# EAGLE design myLCD5Cape (EAGLE 5.11)
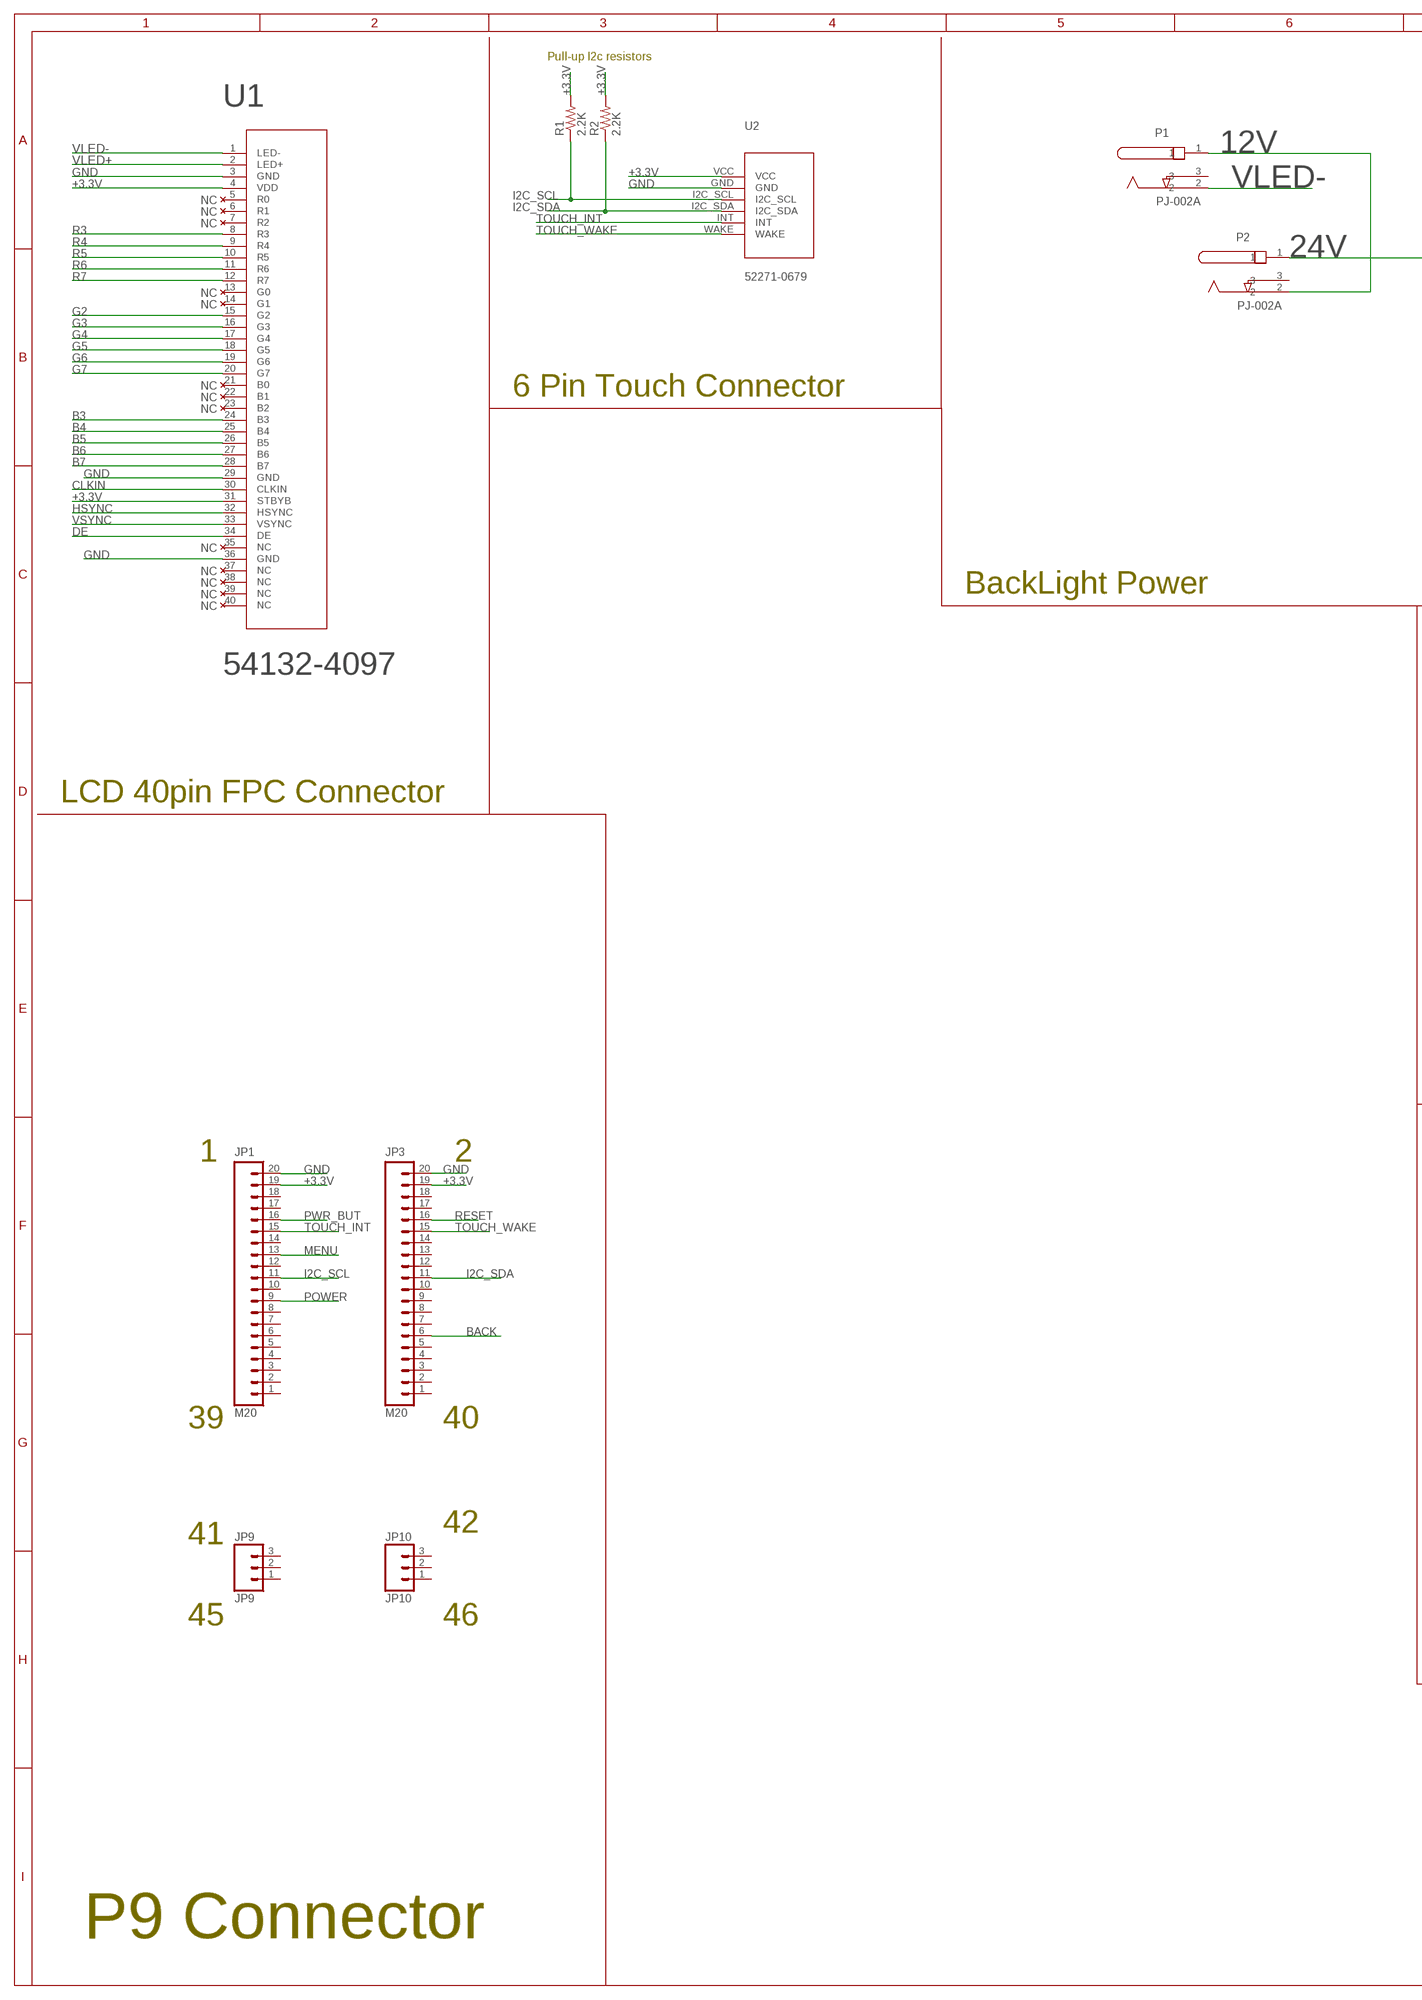
[diagram p0: schematic, sheet 1, part 1 of 2]
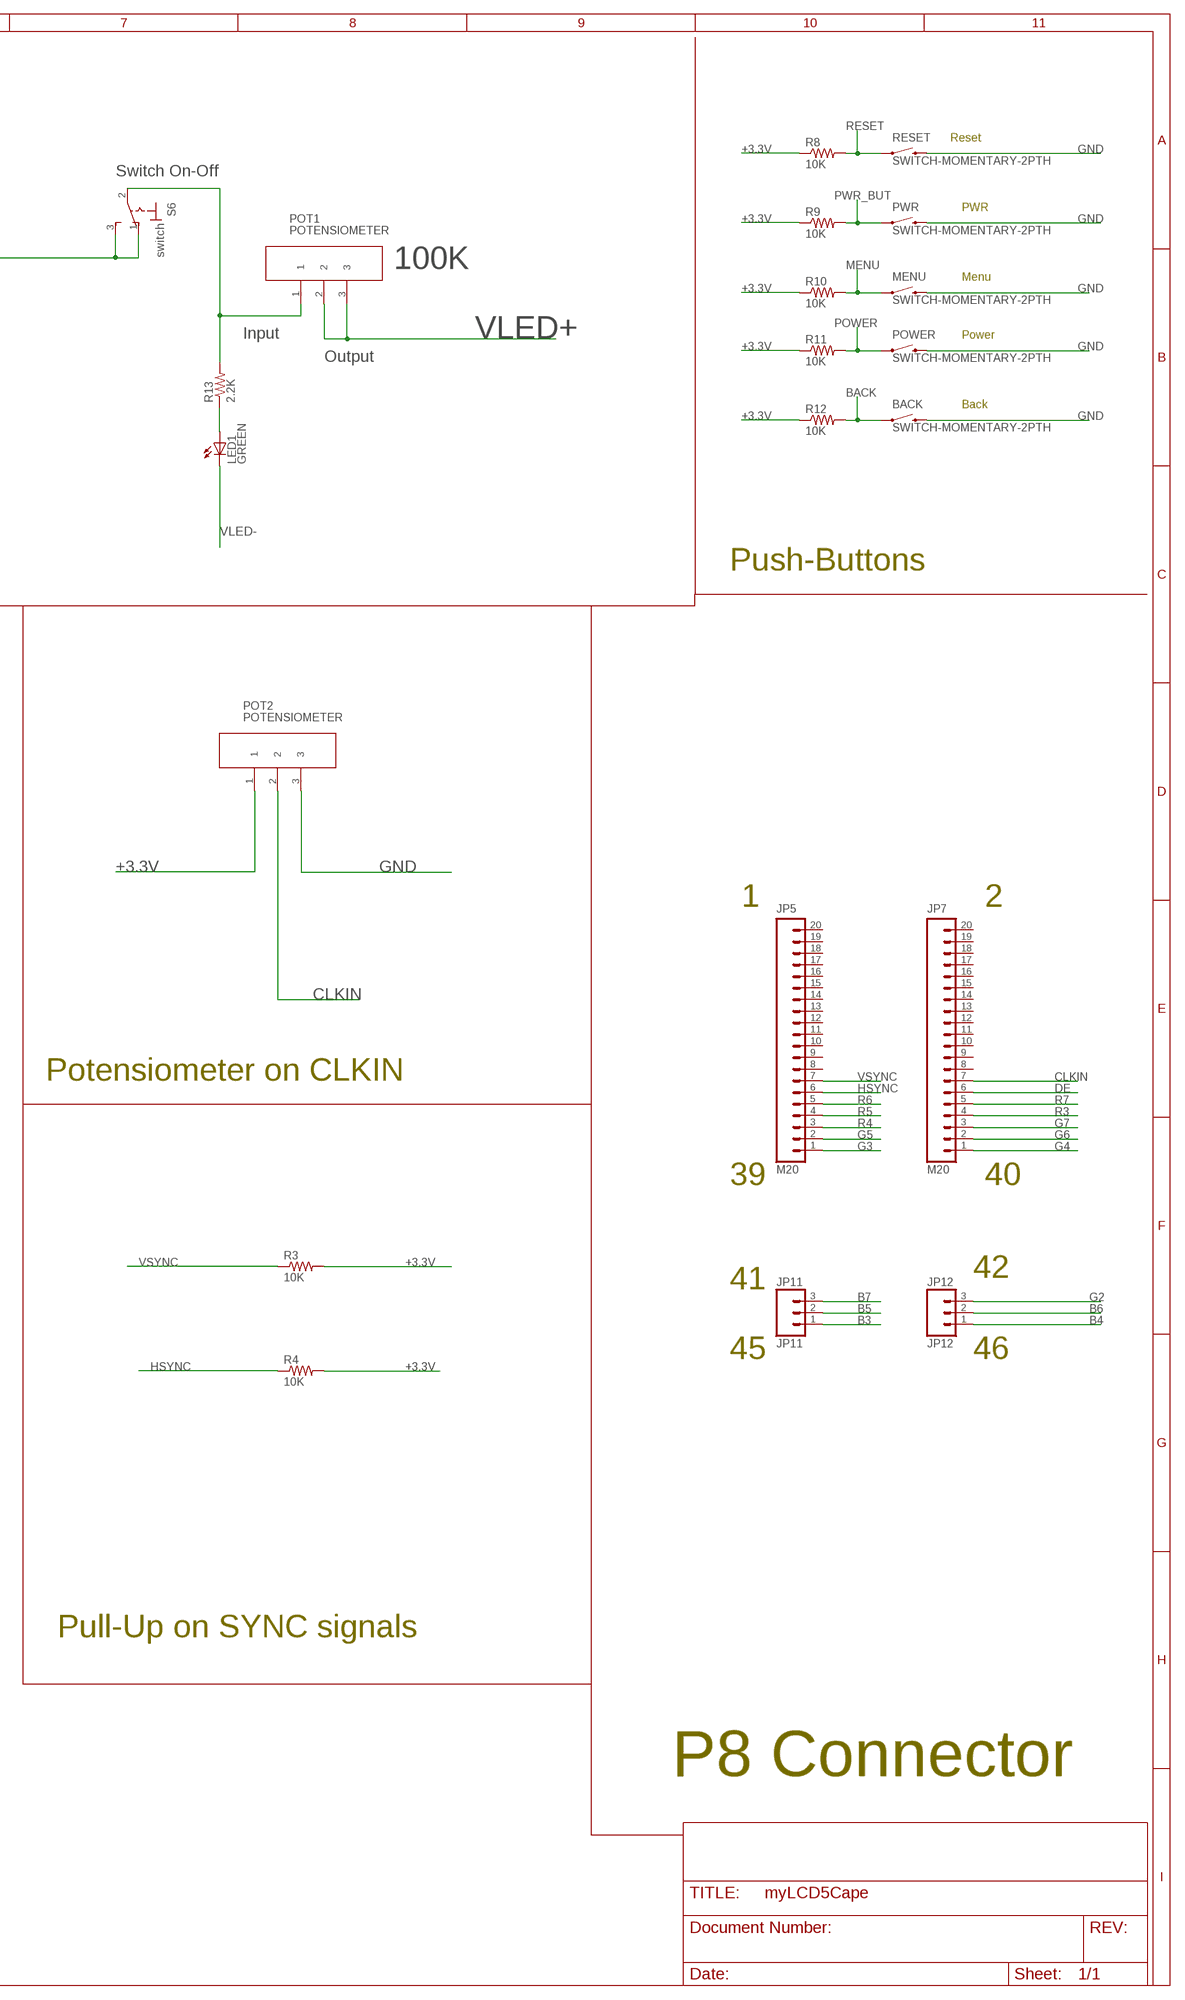
[diagram p1: schematic, sheet 1, part 2 of 2]

## Parts
BACK  SWITCH-MOMENTARY-2PTH  [TACTILE-PTH]
JP1  M20  [1X20]
JP3  M20  [1X20]
JP5  M20  [1X20]
JP7  M20  [1X20]
JP9  JP9  M03PTH  [1X03]
JP10  JP10  M03PTH  [1X03]
JP11  JP11  M03PTH  [1X03]
JP12  JP12  M03PTH  [1X03]
LED1  GREEN  LED5MM  [LED5MM]
MENU  SWITCH-MOMENTARY-2PTH  [TACTILE-PTH]
P1  PJ-002A  [PJ-002A_PACKAGE]
P2  PJ-002A  [PJ-002A_PACKAGE]
POT1  POTENSIOMETER  [POTENSIOMETER_PACKAGE]
POT2  POTENSIOMETER  [POTENSIOMETER_PACKAGE]
POWER  SWITCH-MOMENTARY-2PTH  [TACTILE-PTH]
PWR  SWITCH-MOMENTARY-2PTH  [TACTILE-PTH]
R1  2.2K  RESISTORAXIAL-0.3  [AXIAL-0.3]
R2  2.2K  RESISTORAXIAL-0.3  [AXIAL-0.3]
R3  10K  RESISTORAXIAL-0.3  [AXIAL-0.3]
R4  10K  RESISTORAXIAL-0.3  [AXIAL-0.3]
R8  10K  RESISTORAXIAL-0.3  [AXIAL-0.3]
R9  10K  RESISTORAXIAL-0.3  [AXIAL-0.3]
R10  10K  RESISTORAXIAL-0.3  [AXIAL-0.3]
R11  10K  RESISTORAXIAL-0.3  [AXIAL-0.3]
R12  10K  RESISTORAXIAL-0.3  [AXIAL-0.3]
R13  2.2K  RESISTORAXIAL-0.3  [AXIAL-0.3]
RESET  SWITCH-MOMENTARY-2PTH  [TACTILE-PTH]
S6  switch  320-916  [320-916]
U1  54132-4097  [MOLEX_40_FFC_FPC]
U2  52271-0679  [52271-0679]

## Nets
12V: P1.1 P2.2
24V: POT1.1 R13.P$2 S6.2(P)
+3.3V: JP1.19 JP3.19 POT2.1 R1.P$2 R2.P$2 R3.P$2 R4.P$2 R8.P$1 R9.P$1 R10.P$1 R11.P$1 R12.P$1 U1.4(VDD) U1.31(STBYB) U2.VCC
B3: JP11.1 U1.24(B3)
B4: JP12.1 U1.25(B4)
B5: JP11.2 U1.26(B5)
B6: JP12.2 U1.27(B6)
B7: JP11.3 U1.28(B7)
BACK: BACK.1 JP3.6 R12.P$2
CLKIN: JP7.7 POT2.2 U1.30(CLKIN)
DE: JP7.6 U1.34(DE)
G2: JP12.3 U1.15(G2)
G3: JP5.1 U1.16(G3)
G4: JP7.1 U1.17(G4)
G5: JP5.2 U1.18(G5)
G6: JP7.2 U1.19(G6)
G7: JP7.3 U1.20(G7)
GND: BACK.3 JP1.20 JP3.20 MENU.3 POT2.3 POWER.3 PWR.3 RESET.3 U1.3(GND) U1.29(GND) U1.36(GND) U2.GND
HSYNC: JP5.6 R4.P$1 U1.32(HSYNC)
I2C_SCL: JP1.11 R1.P$1 U2.I2C_SCL
I2C_SDA: JP3.11 R2.P$1 U2.I2C_SDA
MENU: JP1.13 MENU.1 R10.P$2
N$1: LED1.A R13.P$1
N$2: P2.1 S6.1(O) S6.3(S)
POWER: JP1.9 POWER.1 R11.P$2
PWR_BUT: JP1.16 PWR.1 R9.P$2
R3: JP7.4 U1.8(R3)
R4: JP5.3 U1.9(R4)
R5: JP5.4 U1.10(R5)
R6: JP5.5 U1.11(R6)
R7: JP7.5 U1.12(R7)
RESET: JP3.16 R8.P$2 RESET.1
TOUCH_INT: JP1.15 U2.INT
TOUCH_WAKE: JP3.15 U2.WAKE
VLED+: POT1.2 POT1.3 U1.2(LED+)
VLED-: LED1.K(C) P1.2 U1.1(LED-)
VSYNC: JP5.7 R3.P$1 U1.33(VSYNC)
Unconnected: JP1.1 JP1.2 JP1.3 JP1.4 JP1.5 JP1.6 JP1.7 JP1.8 JP1.10 JP1.12 JP1.14 JP1.17 JP1.18 JP3.1 JP3.2 JP3.3 JP3.4 JP3.5 JP3.7 JP3.8 JP3.9 JP3.10 JP3.12 JP3.13 JP3.14 JP3.17 JP3.18 JP5.8 JP5.9 JP5.10 JP5.11 JP5.12 JP5.13 JP5.14 JP5.15 JP5.16 JP5.17 JP5.18 JP5.19 JP5.20 JP7.8 JP7.9 JP7.10 JP7.11 JP7.12 JP7.13 JP7.14 JP7.15 JP7.16 JP7.17 JP7.18 JP7.19 JP7.20 JP9.1 JP9.2 JP9.3 JP10.1 JP10.2 JP10.3 P1.3 P2.3 U1.5(R0) U1.6(R1) U1.7(R2) U1.13(G0) U1.14(G1) U1.21(B0) U1.22(B1) U1.23(B2) U1.35(NC) U1.37(NC) U1.38(NC) U1.39(NC) U1.40(NC)

## Notes on the sheet
- Pull-up I2c resistors
- Reset
- Switch On-Off
- PWR
- 100K
- Menu
- Input | Power
- Output
- 6 Pin Touch Connector
- Back
- Push-Buttons
- BackLight Power
- LCD 40pin FPC Connector
- 1 | 2
- Potensiometer on CLKIN
- 1 | 2
- 39 | 40
- 42
- 41
- 45 | 46
- 39 | 40
- 42
- 41
- 45 | 46
- Pull-Up on SYNC signals
- P8 Connector
- P9 Connector

## Library data of the parts
BACK MENU POWER PWR RESET = SparkFun:SWITCH-MOMENTARY-2
JP1 JP3 JP5 JP7 = SparkFun:M20: This is just like the LOCK variant in that the holes are staggared by 5 mil, but except for the last two holes. They are not altered from the "standard" footprint layout. This is used for a special purpose on the layout of our Graphic LCD Backpack. Make sure you want to use this device before selecting it for you project!
JP9-JP12 = SparkFun:M03: Header 3 Standard 3-pin 0.1" header. Use with straight break away headers (SKU : PRT-00116), right angle break away headers (PRT-00553), swiss pins (PRT-00743), machine pins (PRT-00117), and female headers (PRT-00115). Molex polarized connector foot print use with SKU : PRT-08232 with associated crimp pins and housings.
LED1 = led:LED: LED OSRAM: - CHIPLED LG R971, LG N971, LY N971, LG Q971, LY Q971, LO R971, LY R971 LH N974, LH R974 LS Q976, LO Q976, LY Q976 LO Q996 - Hyper CHIPLED LW Q18S LB Q993, LB Q99A, LB R99A - SideLED LS A670, LO A670, LY A670, LG A670, LP A670 LB A673, LV A673, LT A673, LW A673 LH A674 LY A675 LS A676, LA A676, LO A676, LY A676, LW A676 LS A679, LY A679, LG A679 - Hyper Micro SIDELED® LS Y876, LA Y876, LO Y876, LY Y876 LT Y87S - SmartLED LW L88C, LW L88S LB L89C, LB L89S, LG L890 LS L89K, LO L89K, LY L89K LS L896, LA L896, LO L896, LY L896 - TOPLED LS T670, LO T670, LY T670, LG T670, LP T670 LSG T670, LSP T670, LSY T670, LOP T670, LYG T670 LG T671, LOG T671, LSG T671 LB T673, LV T673, LT T673, LW T673 LH T674 LS T676, LA T676, LO T676, LY T676, LB T676, LH T676, LSB T676, LW T676 LB T67C, LV T67C, LT T67C, LS T67K, LO T67K, LY T67K, LW E67C LS E67B, LA E67B, LO E67B, LY E67B, LB E67C, LV E67C, LT E67C LW T67C LS T679, LY T679, LG T679 LS T770, LO T770, LY T770, LG T770, LP T770 LB T773, LV T773, LT T773, LW T773 LH T774 LS E675, LA E675, LY E675, LS T675 LS T776, LA T776, LO T776, LY T776, LB T776 LHGB T686 LT T68C, LB T68C - Hyper Mini TOPLED® LB M676 - Mini TOPLED Santana® LG M470 LS M47K, LO M47K, LY M47K Source: http://www.osram.convergy.de LUXEON: - LUMILED® LXK2-PW12-R00, LXK2-PW12-S00, LXK2-PW14-U00, LXK2-PW14-V00 LXK2-PM12-R00, LXK2-PM12-S00, LXK2-PM14-U00 LXK2-PE12-Q00, LXK2-PE12-R00, LXK2-PE12-S00, LXK2-PE14-T00, LXK2-PE14-U00 LXK2-PB12-K00, LXK2-PB12-L00, LXK2-PB12-M00, LXK2-PB14-N00, LXK2-PB14-P00, LXK2-PB14-Q00 LXK2-PR12-L00, LXK2-PR12-M00, LXK2-PR14-Q00, LXK2-PR14-R00 LXK2-PD12-Q00, LXK2-PD12-R00, LXK2-PD12-S00 LXK2-PH12-R00, LXK2-PH12-S00 LXK2-PL12-P00, LXK2-PL12-Q00, LXK2-PL12-R00 Source: www.luxeon.com KINGBRIGHT: KA-3528ASYC Source: www.kingbright.com
P1 P2 = beaglebone_components:PJ-002A: JACK POWER CONNECTOR PJ-002A
POT1 POT2 = beaglebone_components:POTENSIOMETER: gENERAL pOTENSIOMETER
R1-R4 R8-R13 = SparkFun:RESISTOR: Resistor Basic schematic elements and footprints for 0603, 1206, and PTH resistors.
S6 = switch:320-916: TOGGLE SWITCH distributor RS Components
U1 = beaglebone_components:54132-4097: MOLEX 40 PIN FPC
U2 = beaglebone_components:52271-0679: tOUCHSCREEN FPC 6 PINS CONNECTOR

## Board
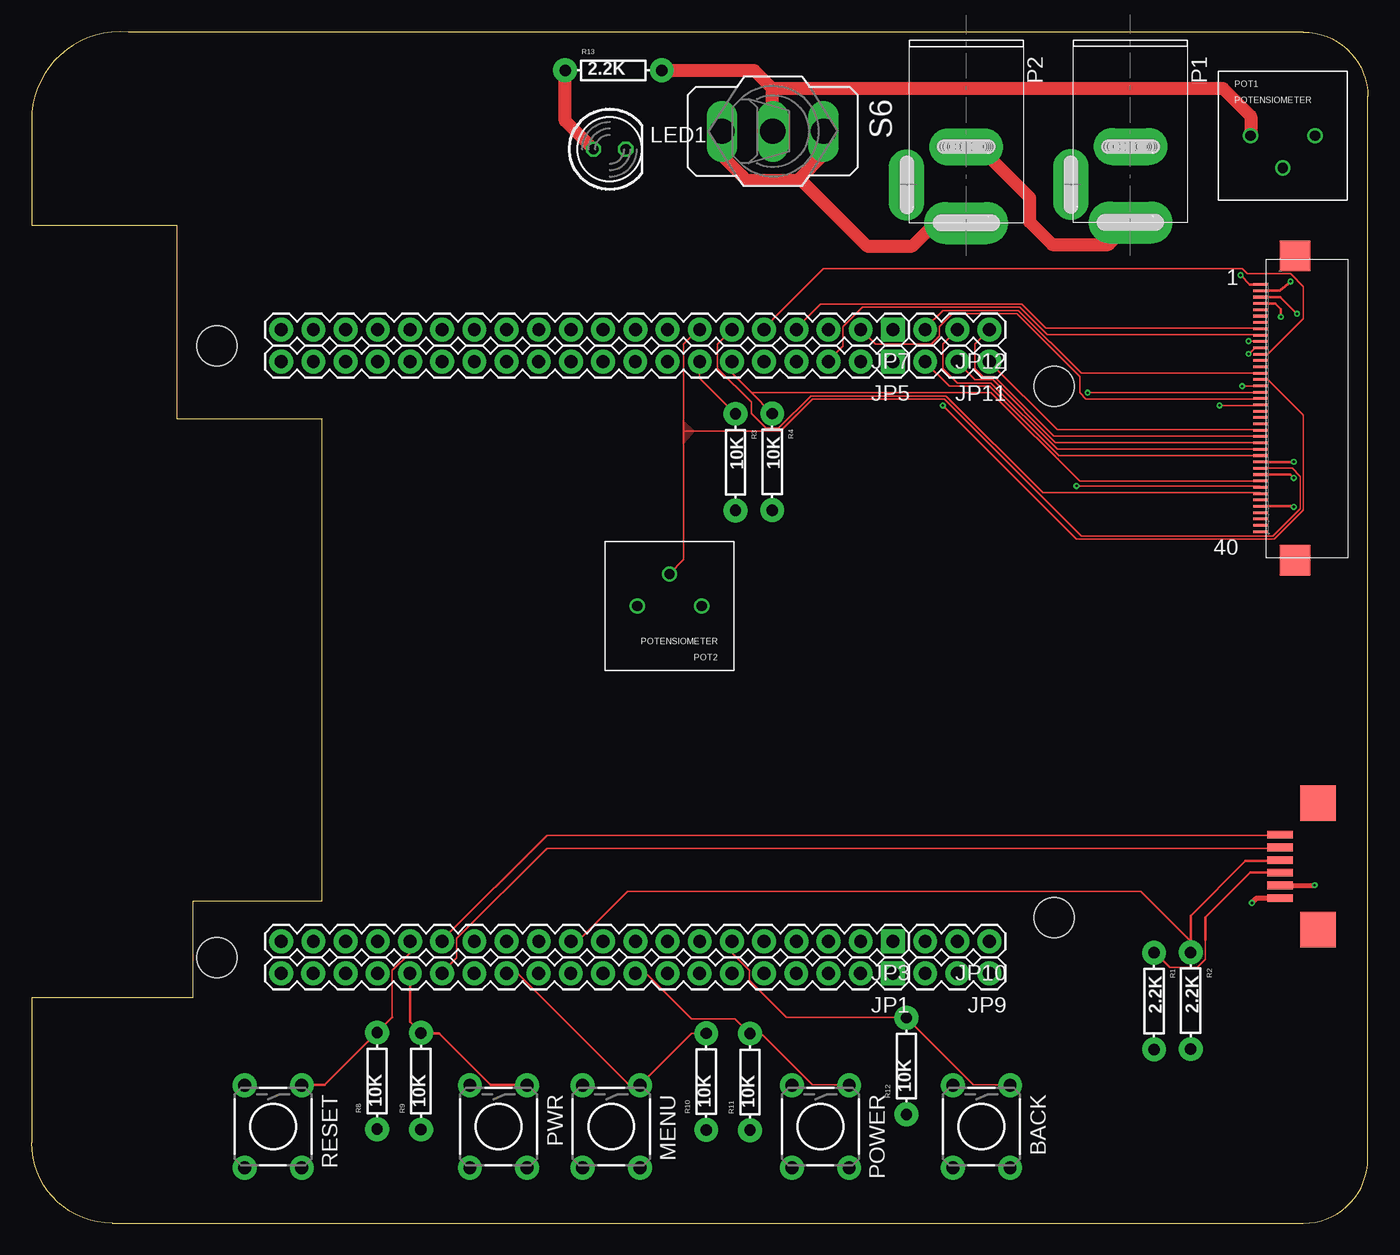
[diagram p2: board, top side]
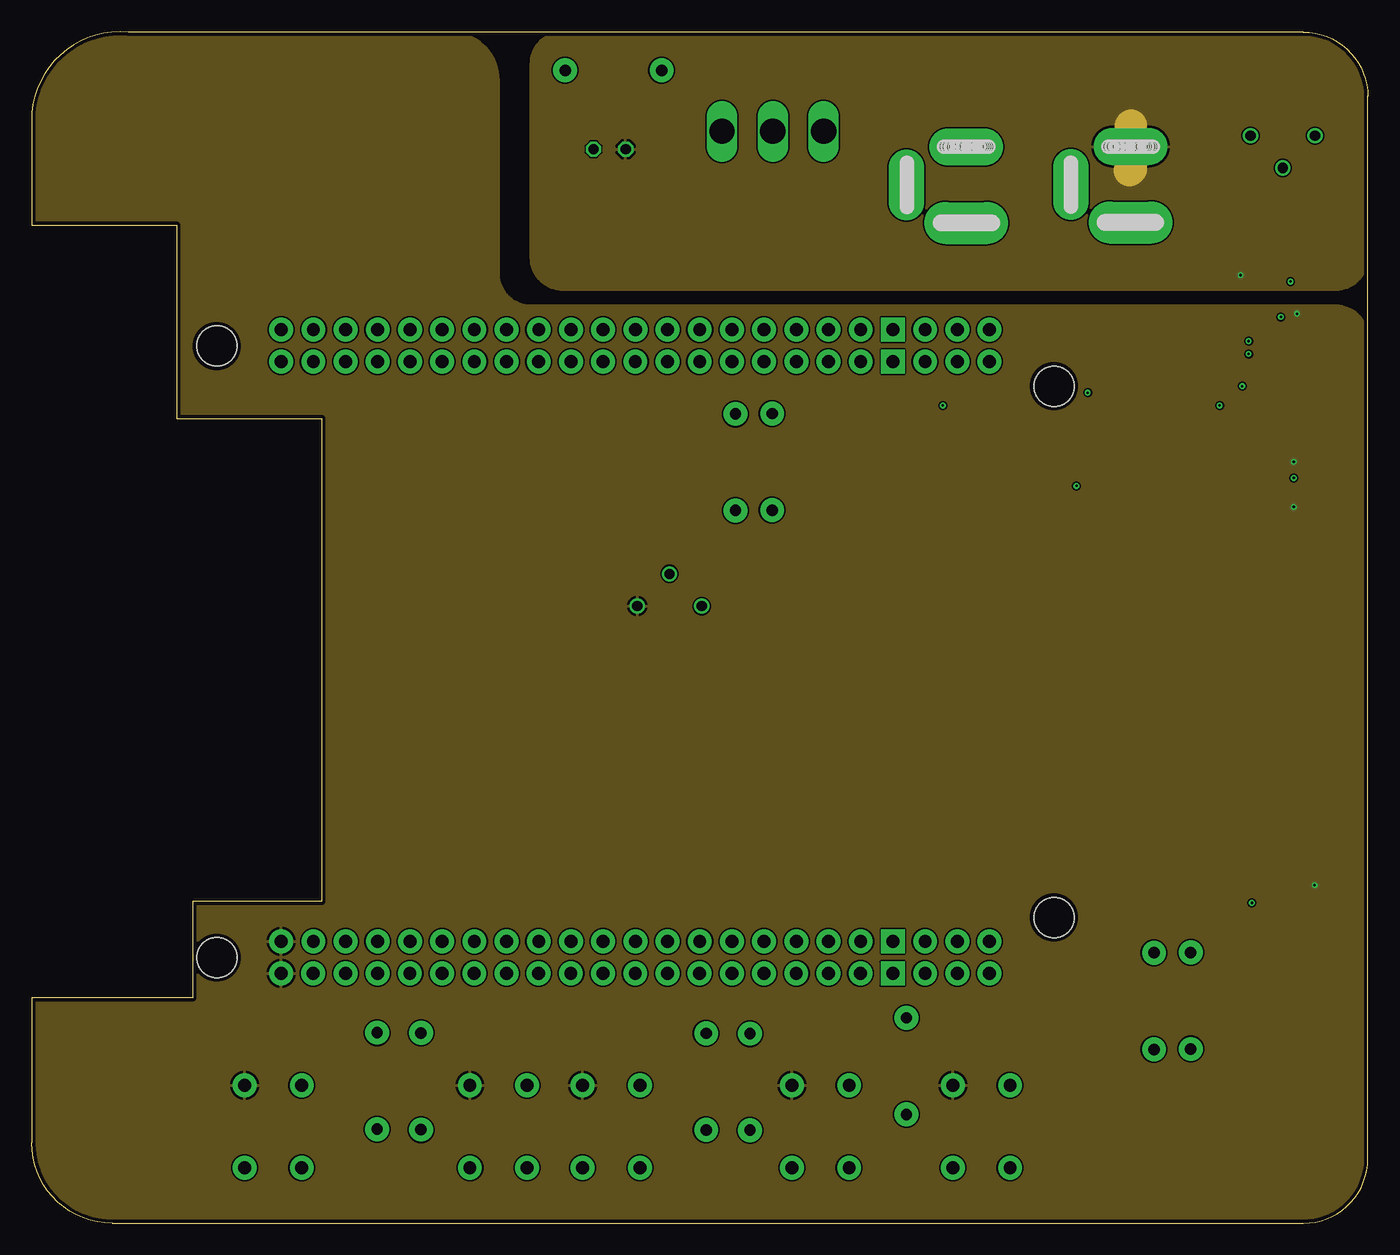
[diagram p3: board, inner layer Route2]
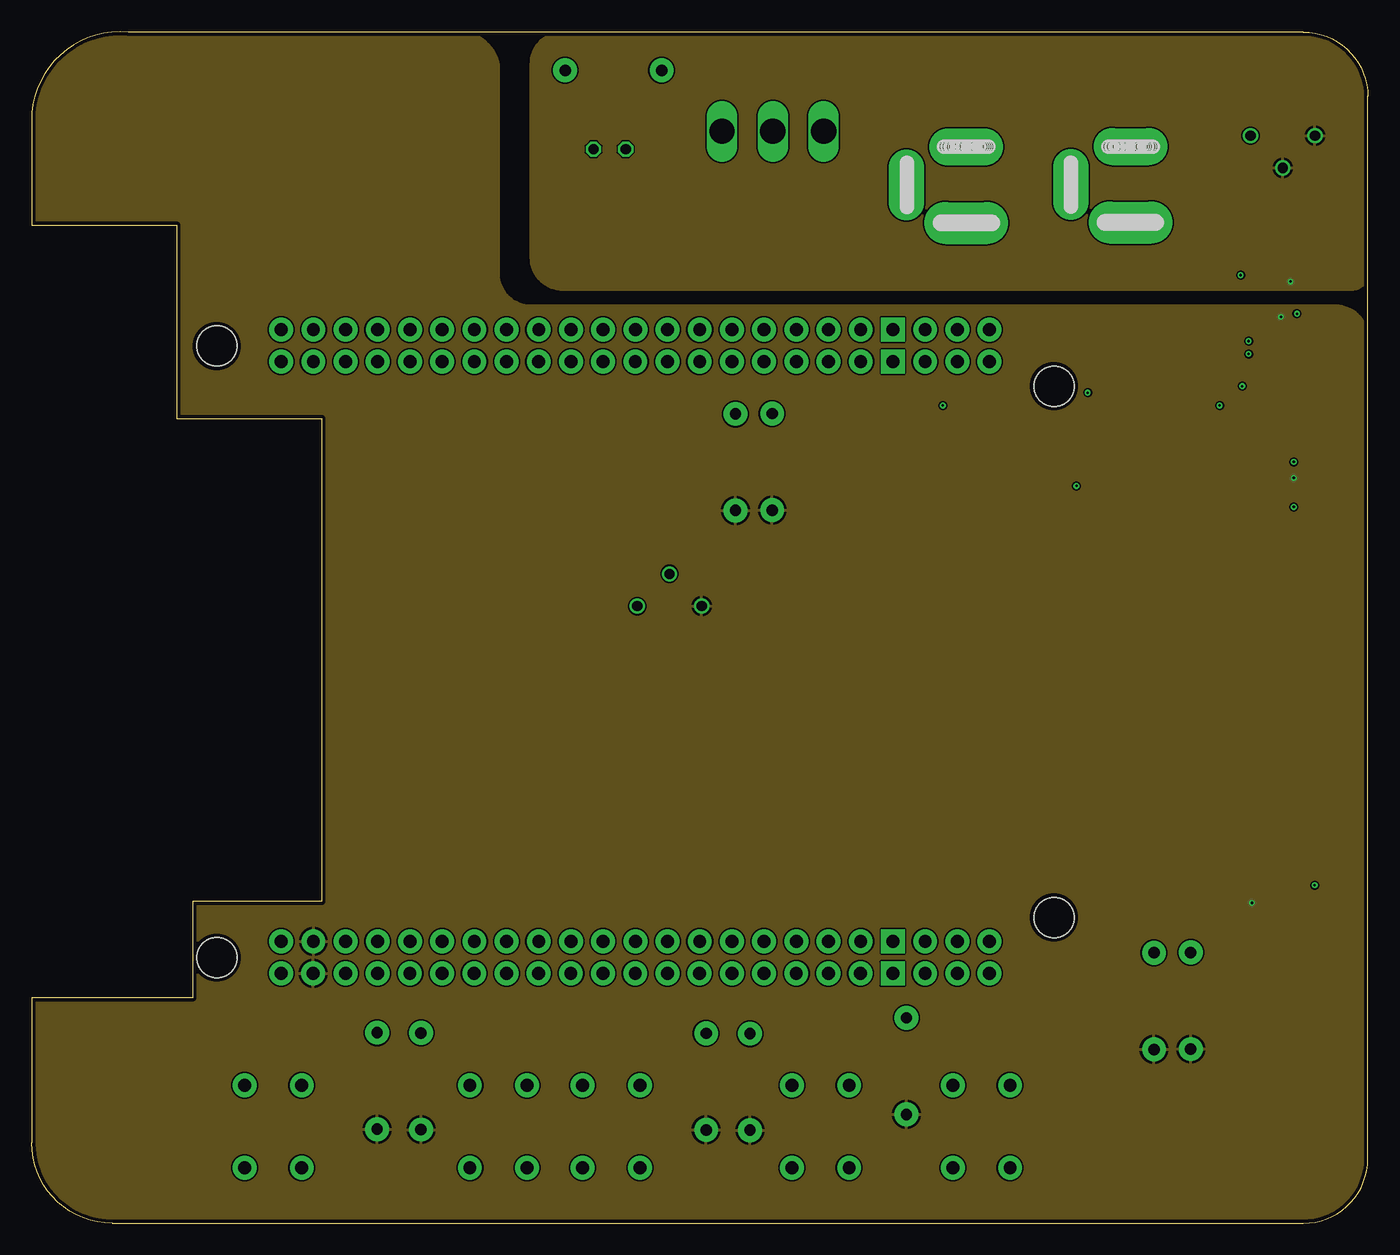
[diagram p4: board, inner layer Route15]
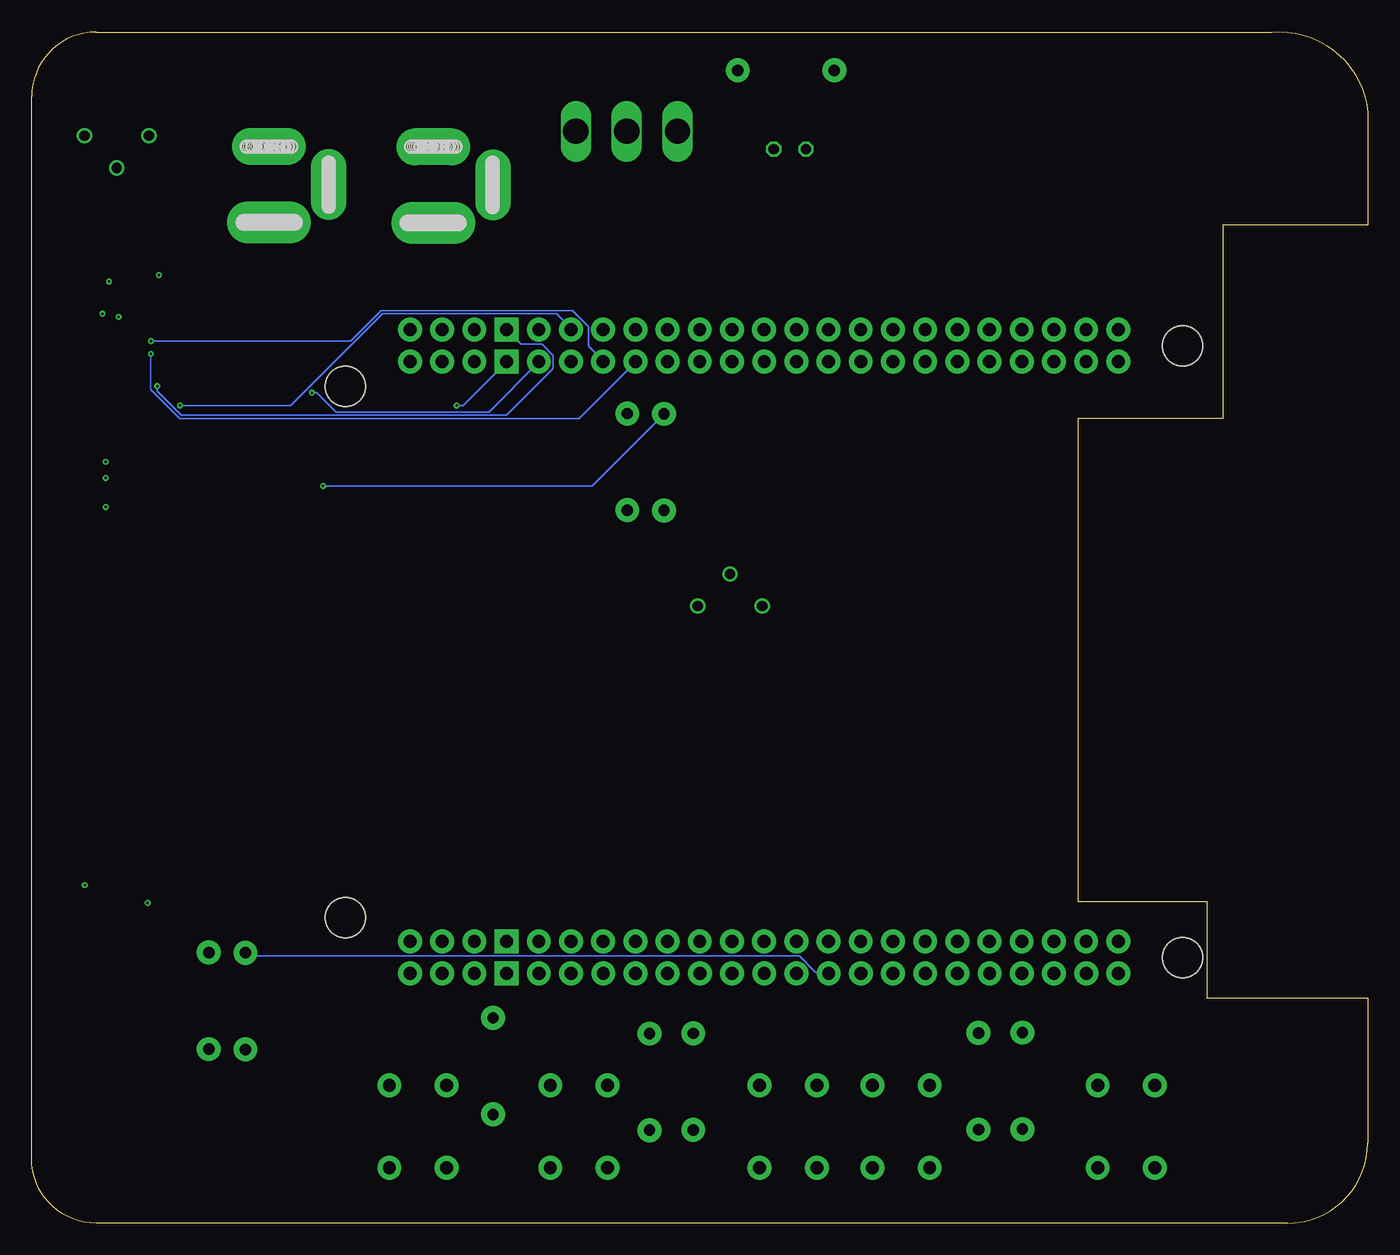
[diagram p5: board, bottom side, seen from below]

Size 105.41 x 94.01 mm. Coordinates in mm from the lower left corner, seen from the top.
Outline: 105.41,5.08 105.41,88.9 arc90 100.33,93.98 7.62,93.98 arc90 0,87.63 0,78.74 11.43,78.74 11.43,63.5 22.86,63.5 22.86,25.4 12.7,25.4 12.7,17.78 0,17.78 0,6.35 arc90 6.35,0 100.33,0 arc90 105.41,5.08
Copper layers (1*2+15*16): Top 0.035mm / dielectric 1.5mm / Route2 0.035mm / dielectric 0.15mm / Route15 0.035mm / dielectric 0.2mm / Bottom 0.035mm
Design rules "PCB-POOL HighSpec *": minimum track width 0.125mm, minimum drill 0.2mm, track to track 0.125mm, track to pad 0.125mm, pad to pad 0.125mm, via to via 0.125mm, smd to smd 0.125mm, copper to edge 0.3mm, drill to drill 0.2mm, minimum pad ring 0.2mm, minimum via ring 0.125mm, stop-mask expansion 0.075mm, vias tented up to drill 0mil, thermal gap 0.2mm
Holes 3.17 mm at 14.61,20.96 14.61,69.22 80.64,24.13 80.64,66.04

### Footprints (pad centres in the part's own frame; a part is rotated, then mirrored left to right if it is on the bottom)
TACTILE-PTH = drill 1.016 pad 1.88 round: 1 -3.251,2.261; 2 3.251,2.261; 3 -3.251,-2.261; 4 3.251,-2.261
1X20 = drill 1.016 pad 1.88 square: 1 0,0 | drill 1.016 pad 1.88 round: 2 2.54,0; 3 5.08,0; 4 7.62,0; 5 10.16,0; 6 12.7,0; 7 15.24,0; 8 17.78,0; 9 20.32,0; 10 22.86,0; 11 25.4,0; 12 27.94,0; 13 30.48,0; 14 33.02,0; 15 35.56,0; 16 38.1,0; 17 40.64,0; 18 43.18,0; 19 45.72,0; 20 48.26,0
1X03 = drill 1.016 pad 1.88 round: 1 0,0; 2 2.54,0; 3 5.08,0
LED5MM = drill 0.813 octagon: A -1.27,0; K 1.27,0
PJ-002A_PACKAGE = drill 1.2 pad 3.302 long: 1 6.907,-0.004 | drill 1 pad 2.921 long: 2 0.907,-0.004 | drill 1 pad 2.794 long: 3 3.907,-4.714 | hole 1: 0.907,-0.154; 0.907,-0.304; 0.907,-0.454; 0.907,-0.604; 0.907,-0.754; 0.907,-0.904; 0.907,-1.054; 0.907,-1.154; 0.907,-1.254; 0.907,-1.404; 0.907,-1.504; 0.907,-1.654; 0.907,-1.754; 0.907,0.146; 0.907,0.296; 0.907,0.446; 0.907,0.596; 0.907,0.746; 0.907,0.896; 0.907,1.046; 0.907,1.196; 0.907,1.346; 0.907,1.496; 0.907,1.646; 0.907,1.746; 4.007,-4.704; 4.107,-4.704; 4.207,-4.704; 4.307,-4.704; 4.407,-4.704; 4.507,-4.704; 4.607,-4.704; 4.707,-4.704; 4.807,-4.704; 4.907,-4.704; 5.007,-4.704; 5.107,-4.704; 5.207,-4.704; 5.307,-4.704; 5.407,-4.704; 5.507,-4.704; 5.607,-4.704; 5.657,-4.704; 3.807,-4.704; 3.707,-4.704; 3.607,-4.704; 3.507,-4.704; 3.407,-4.704; 3.307,-4.704; 3.207,-4.704; 3.107,-4.704; 3.007,-4.704; 2.907,-4.704; 2.807,-4.704; 2.707,-4.704; 2.607,-4.704; 2.507,-4.704; 2.407,-4.704; 2.307,-4.704; 2.207,-4.704; 2.157,-4.704 | hole 1.2: 6.907,-0.104; 6.907,-0.204; 6.907,-0.304; 6.907,-0.404; 6.907,-2.004; 6.907,1.996; 6.907,1.896; 6.907,1.796; 6.907,1.696; 6.907,1.596; 6.907,1.496; 6.907,1.396; 6.907,1.296; 6.907,1.196; 6.907,1.096; 6.907,0.996; 6.907,0.896; 6.907,0.796; 6.907,0.696; 6.907,0.596; 6.907,0.496; 6.907,0.396; 6.907,0.296; 6.907,0.196; 6.907,0.096; 6.907,-0.504; 6.907,-0.604; 6.907,-0.704; 6.907,-0.804; 6.907,-0.904; 6.907,-1.004; 6.907,-1.104; 6.907,-1.204; 6.907,-1.304; 6.907,-1.404; 6.907,-1.504; 6.907,-1.604; 6.907,-1.704; 6.907,-1.804; 6.907,-1.904
POTENSIOMETER_PACKAGE = drill 0.8 round: 1 -2.54,0; 2 0,-2.54; 3 2.54,0
AXIAL-0.3 = drill 0.9 pad 1.88 round: P$1 -3.81,0; P$2 3.81,0
320-916 = drill 2.007 long: 1 0,4.013; 2 0,0; 3 0,-4.013
MOLEX_40_FFC_FPC = smd 1.2 x 0.2: 1 -4.04,9.12; 2 -4.04,8.62; 3 -4.04,8.12; 4 -4.04,7.62; 5 -4.04,7.12; 6 -4.04,6.62; 7 -4.04,6.12; 8 -4.04,5.62; 9 -4.04,5.12; 10 -4.04,4.62; 11 -4.04,4.12; 12 -4.04,3.62; 13 -4.04,3.12; 14 -4.04,2.62; 15 -4.04,2.12; 16 -4.04,1.62; 17 -4.04,1.12; 18 -4.04,0.62; 19 -4.04,0.12; 20 -4.04,-0.38; 21 -4.04,-0.88; 22 -4.04,-1.38; 23 -4.04,-1.88; 24 -4.04,-2.38; 25 -4.04,-2.88; 26 -4.04,-3.38; 27 -4.04,-3.88; 28 -4.04,-4.38; 29 -4.04,-4.88; 30 -4.04,-5.38; 31 -4.04,-5.88; 32 -4.04,-6.38; 33 -4.04,-6.88; 34 -4.04,-7.38; 35 -4.04,-7.88; 36 -4.04,-8.38; 37 -4.04,-8.88; 38 -4.04,-9.38; 39 -4.04,-9.88; 40 -4.04,-10.38 | smd 2.4 x 2.4: SOLDERED1 -1.34,-12.63; SOLDERED2 -1.34,11.37
52271-0679 = smd 0.6 x 2: GND 1,1; I2C_SCL 2,1; I2C_SDA 3,1; INT 4,1; VCC 0,1; WAKE 5,1 | smd 2.8 x 2.8: P$7 -2.5,-2; P$8 7.5,-2

### Placement (x,y rotation side)
BACK  74.93,7.62 270 top
JP1  67.94,19.71 180 top
JP3  67.94,22.25 180 top
JP5  67.94,67.98 180 top
JP7  67.94,70.51 180 top
JP9  75.56,19.71 180 top
JP10  75.56,22.25 180 top
JP11  75.56,67.97 180 top
JP12  75.56,70.51 180 top
LED1  45.59,84.73 0 top
MENU  45.72,7.62 270 top
P1  86.69,85.85 270 top
P2  73.74,85.83 270 top
POT1  98.7,85.8 0 top
POT2  50.32,48.69 180 top
POWER  62.23,7.62 270 top
PWR  36.83,7.62 270 top
R1  88.54,17.53 270 top
R2  91.44,17.55 270 top
R3  55.52,60.05 270 top
R4  58.42,60.07 270 top
R8  27.25,11.23 90 top
R9  30.71,11.2 90 top
R10  53.21,11.18 90 top
R11  56.67,11.15 90 top
R12  69.01,12.4 90 top
R13  45.9,90.96 0 top
RESET  19.05,7.62 270 top
S6  58.47,86.16 270 top
U1  101.02,64.95 0 top
U2  99.49,25.65 90 top

### Tracks (layer width: path | path; a pad name or v marks a point on that pad's centre or on a via)
12V
  Top 1.016: P2.2 74.72,84.92 78.74,80.9 78.74,78.99 80.52,77.22 84.96,77.22 P1.1
24V
  Top 0.61: 58.42,86.21 S6.2
  Top 1.016: R13.P$2 57,90.96 58.42,89.53 58.42,89.28 | 58.42,89.28 58.42,86.21 | POT1.1 96.16,87.35 93.98,89.53 58.67,89.53 58.42,89.28
+3.3V  (via drill 0.2 pad 0.46)
  Top 0.203: U1.4 98.12,72.57 98.55,72.14 v98.55,71.5 | U1.31 99.3,59.07 v99.57,58.8
  Top 0.406: U2.VCC 96.65,25.65 v96.27,25.27
  pour Route15: 0,0 100.33,0 arc90 105.41,5.08 105.41,69.85 arc90 102.87,72.39 39.37,72.39 arc-90 36.83,74.93 36.83,91.44 arc90 33.02,93.98 0,93.98
B3
  Top 0.125: U1.24 96.9,62.61 80.9,62.61 75.56,67.94 JP11.1
B4
  Top 0.125: U1.25 96.9,62.1 80.64,62.1 75.95,66.8 75.06,66.8 74.42,67.44 74.42,69.34 75.56,70.48 JP12.1
B5
  Top 0.125: U1.26 96.9,61.59 80.77,61.59 75.82,66.55 74.42,66.55 73.03,67.94 JP11.2
B6
  Top 0.125: U1.27 96.9,61.09 80.9,61.09 75.69,66.29 73.03,66.29 71.88,67.44 71.88,69.34 73.03,70.48 JP12.2
B7
  Top 0.125: U1.28 96.9,60.58 81.03,60.58 75.56,66.04 72.39,66.04 70.48,67.94 JP11.3
BACK
  Top 0.125: JP3.6 55.24,21.34 56.64,19.94 56.64,19.18 59.56,16.26 68.96,16.26 R12.P$2 74.3,10.92 77.09,10.92 BACK.1
CLKIN
  Top 0.125: 51.44,62.48 59.05,62.48 61.59,65.02 72.01,65.02 82.8,54.23 97.92,54.23 100.08,56.39 100.08,58.93 99.44,59.56 97.03,59.56 U1.30
  Top 0.127: JP7.7 52.6,70.51 51.44,69.34 51.44,62.48 51.44,52.35 POT2.2
  pour Top: 51.44,63.25 52.2,62.48 51.44,61.59
DE
  Top 0.125: U1.34 96.9,57.66 79.76,57.66 72.14,65.28 61.47,65.28 58.93,62.74 57.91,62.74 56.77,63.88 56.77,64.77 54.1,67.44 54.1,69.34 55.24,70.48 JP7.6
G2
  Top 0.125: U1.15 96.9,67.06 82.8,67.06 77.85,72.01 71.88,72.01 70.48,70.61 JP12.3
G3  (via drill 0.2)
  Top 0.125: v71.88,64.52 82.42,53.98 98.04,53.98 100.33,56.26 100.33,63.75 97.54,66.55 97.03,66.55 U1.16
  Bottom 0.125: v71.88,64.52 71.37,64.52 67.94,67.94 JP5.1
G4  (via drill 0.2)
  Top 0.125: v95.5,66.04 96.9,66.04 U1.17
  Bottom 0.125: v95.5,66.04 95.5,65.66 93.6,63.75 67.94,63.75 64.26,67.44 64.26,68.45 65.15,69.34 66.8,69.34 67.94,70.48 JP7.1
G5  (via drill 0.2)
  Top 0.125: v83.31,65.53 96.9,65.53 U1.18
  Bottom 0.125: v83.31,65.53 82.93,65.53 81.41,64.01 69.34,64.01 65.41,67.94 JP5.2
G6
  Top 0.125: U1.19 96.9,65.02 83.19,65.02 82.68,65.53 82.68,66.8 77.72,71.75 72.64,71.75 71.63,70.74 71.63,69.98 70.99,69.34 66.55,69.34 65.41,70.48 JP7.2
G7  (via drill 0.2)
  Top 0.125: v93.73,64.52 96.9,64.52 U1.20
  Bottom 0.125: v93.73,64.52 84.96,64.52 77.72,71.75 64.01,71.75 62.87,70.61 JP7.3
GND  (via drill 0.2 pad 0.46)
  Top 0.203: U1.36 99.52,56.57 v99.57,56.52 | U1.29 v99.56,60.07 v99.57,60.07 | U1.3 98.51,73.07 v99.82,71.75
  Top 0.406: U2.GND 101.22,26.65 v101.22,26.67
  pour Route2: 0,0 105.41,0 105.41,69.85 arc90 102.87,72.39 93.98,72.39 39.37,72.39 arc-90 36.83,74.93 36.83,90.17 arc90 33.02,93.98 29.21,93.98 0,93.98
HSYNC
  Top 0.125: 56.77,65.53 75.69,65.53 82.68,58.55 96.9,58.55 U1.32
  Top 0.127: JP5.6 55.24,67.06 56.77,65.53 R4.P$1
I2C_SCL
  Top 0.125: 97.79,27.56 98.42,27.56 U2.I2C_SCL | 92.58,22.35 92.58,20.83 91.95,20.19 89.79,20.19 88.65,21.34 R1.P$1
  Top 0.203: 92.58,22.35 92.58,24.13 96.14,27.69 97.66,27.69 97.79,27.56
  Bottom 0.125: JP1.11 42.55,19.81 43.56,19.81 44.83,21.08 88.27,21.08 88.52,21.34 R1.P$1
I2C_SDA
  Top 0.125: 97.79,28.58 98.42,28.58 U2.I2C_SDA | JP3.11 42.55,22.35 43.18,22.35 46.99,26.16 87.5,26.16 91.44,22.23 R2.P$1 91.44,21.46
  Top 0.203: 97.79,28.58 95.76,28.58 91.44,24.26 R2.P$1
MENU
  Top 0.125: JP1.13 37.47,19.69 38.35,19.69 47.12,10.92 47.88,10.92 MENU.1 48.01,10.92 52.07,14.99 R10.P$2
N$1
  Top 1.016: R13.P$1 42.09,86.97 LED1.A
N$2
  Top 0.61: 60.45,82.3 60.58,82.42 | 62.48,84.33 S6.1
  Top 1.016: S6.3 54.46,84.23 56.39,82.3 60.45,82.3 | 62.48,84.33 60.58,82.42 65.91,77.09 69.47,77.09 71.3,78.92 P2.1
POWER
  Top 0.125: JP1.9 47.62,19.69 48.51,19.69 52.07,16.13 55.5,16.13 R11.P$2 56.77,14.86 57.66,14.86 61.59,10.92 64.39,10.92 POWER.1
PWR_BUT
  Top 0.125: JP1.16 29.84,19.69 | 38.99,10.92 PWR.1 | R9.P$2 30.73,14.99
  Top 0.203: 29.84,19.69 29.84,15.88 R9.P$2 | 38.99,10.92 36.2,10.92 32.13,14.99 30.73,14.99
R3
  Top 0.125: U1.8 96.9,70.61 80.01,70.61 78.11,72.52 62.23,72.52 60.33,70.61 JP7.4
R4
  Top 0.125: U1.9 96.9,70.1 80.14,70.1 77.98,72.26 65.53,72.26 64.01,70.74 64.01,69.22 62.87,68.07 JP5.3
R5  (via drill 0.2)
  Top 0.125: v96.01,69.6 96.9,69.6 U1.10
  Bottom 0.125: v96.01,69.6 80.26,69.6 77.85,72.01 62.74,72.01 61.47,70.74 61.47,69.22 60.33,68.07 JP5.4
R6  (via drill 0.2)
  Top 0.125: v96.01,68.58 96.52,69.09 96.9,69.09 U1.11
  Bottom 0.125: v96.01,68.58 96.01,65.79 93.73,63.5 62.23,63.5 57.78,67.94 JP5.5
R7
  Top 0.125: U1.12 97.03,68.58 97.54,68.58 100.33,71.37 100.33,73.91 99.31,74.93 95.89,74.93 95.5,75.31 62.48,75.31 57.78,70.61 JP7.5
RESET
  Top 0.125: RESET.1 21.34,10.92 | 27.18,14.99 R8.P$2 27.3,15.11 | 28.45,16.26 28.45,19.94 29.84,21.34 JP3.16
  Top 0.203: 21.34,10.92 23.11,10.92 27.18,14.99 | 27.3,15.11 28.45,16.26
TOUCH_INT
  Top 0.125: U2.INT 98.42,29.59 40.64,29.59 33.53,22.48 33.53,20.96 32.38,19.81 JP1.15
TOUCH_WAKE
  Top 0.125: U2.WAKE 98.42,30.61 40.64,30.61 32.38,22.35 JP3.15
VLED+  (via drill 0.2 pad 0.46)
  Top 0.203: U1.2 98.46,73.57 v99.31,74.3
  pour Route15: 44.45,73.66 104.14,73.66 arc90 105.41,74.93 105.41,93.98 41.91,93.98 arc90 39.37,91.44 39.37,76.2 arc90 41.91,73.66
VLED-  (via drill 0.2 pad 0.46)
  Top 0.203: U1.1 96.11,74.07 v95.38,74.8
  Route2 2.54: P1.2 86.69,86.56 86.74,86.61 86.74,83.19 86.61,83.06
  pour Route2: 39.37,90.17 39.37,91.44 arc-90 41.91,93.98 100.33,93.98 arc-90 105.41,88.9 105.41,76.2 arc-90 102.87,73.66 41.91,73.66 arc-90 39.37,76.2
VSYNC  (via drill 0.2)
  Top 0.125: v82.42,58.17 96.9,58.17 U1.33
  Top 0.127: JP5.7 52.7,66.68 R3.P$1
  Bottom 0.125: v82.42,58.17 61.21,58.17 R3.P$1